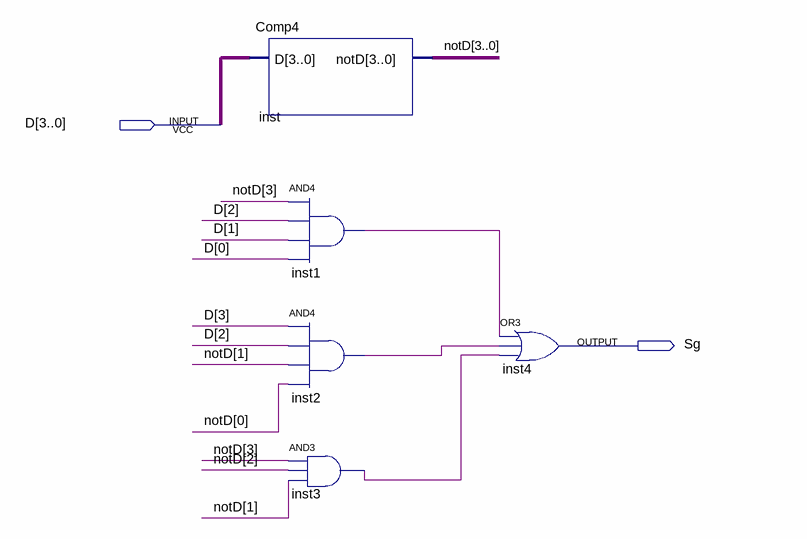
[diagram p0: schematic sheet]
// Quartus schematic Sg.bdf as structural Verilog: 5 symbols, 2 pins
module Sg (
  input  [3:0] D,
  output Sg
);

  wire inst1_out, inst2_out, inst3_out;
  wire [3:0] notD;

  Comp4 inst (.D(D), .notD(notD));
  and inst1 (inst1_out, notD[3], D[2], D[1], D[0]);
  and inst2 (inst2_out, D[3], D[2], notD[1], notD[0]);
  and inst3 (inst3_out, notD[3], notD[2], notD[1]);
  or inst4 (Sg, inst1_out, inst2_out, inst3_out);
endmodule
